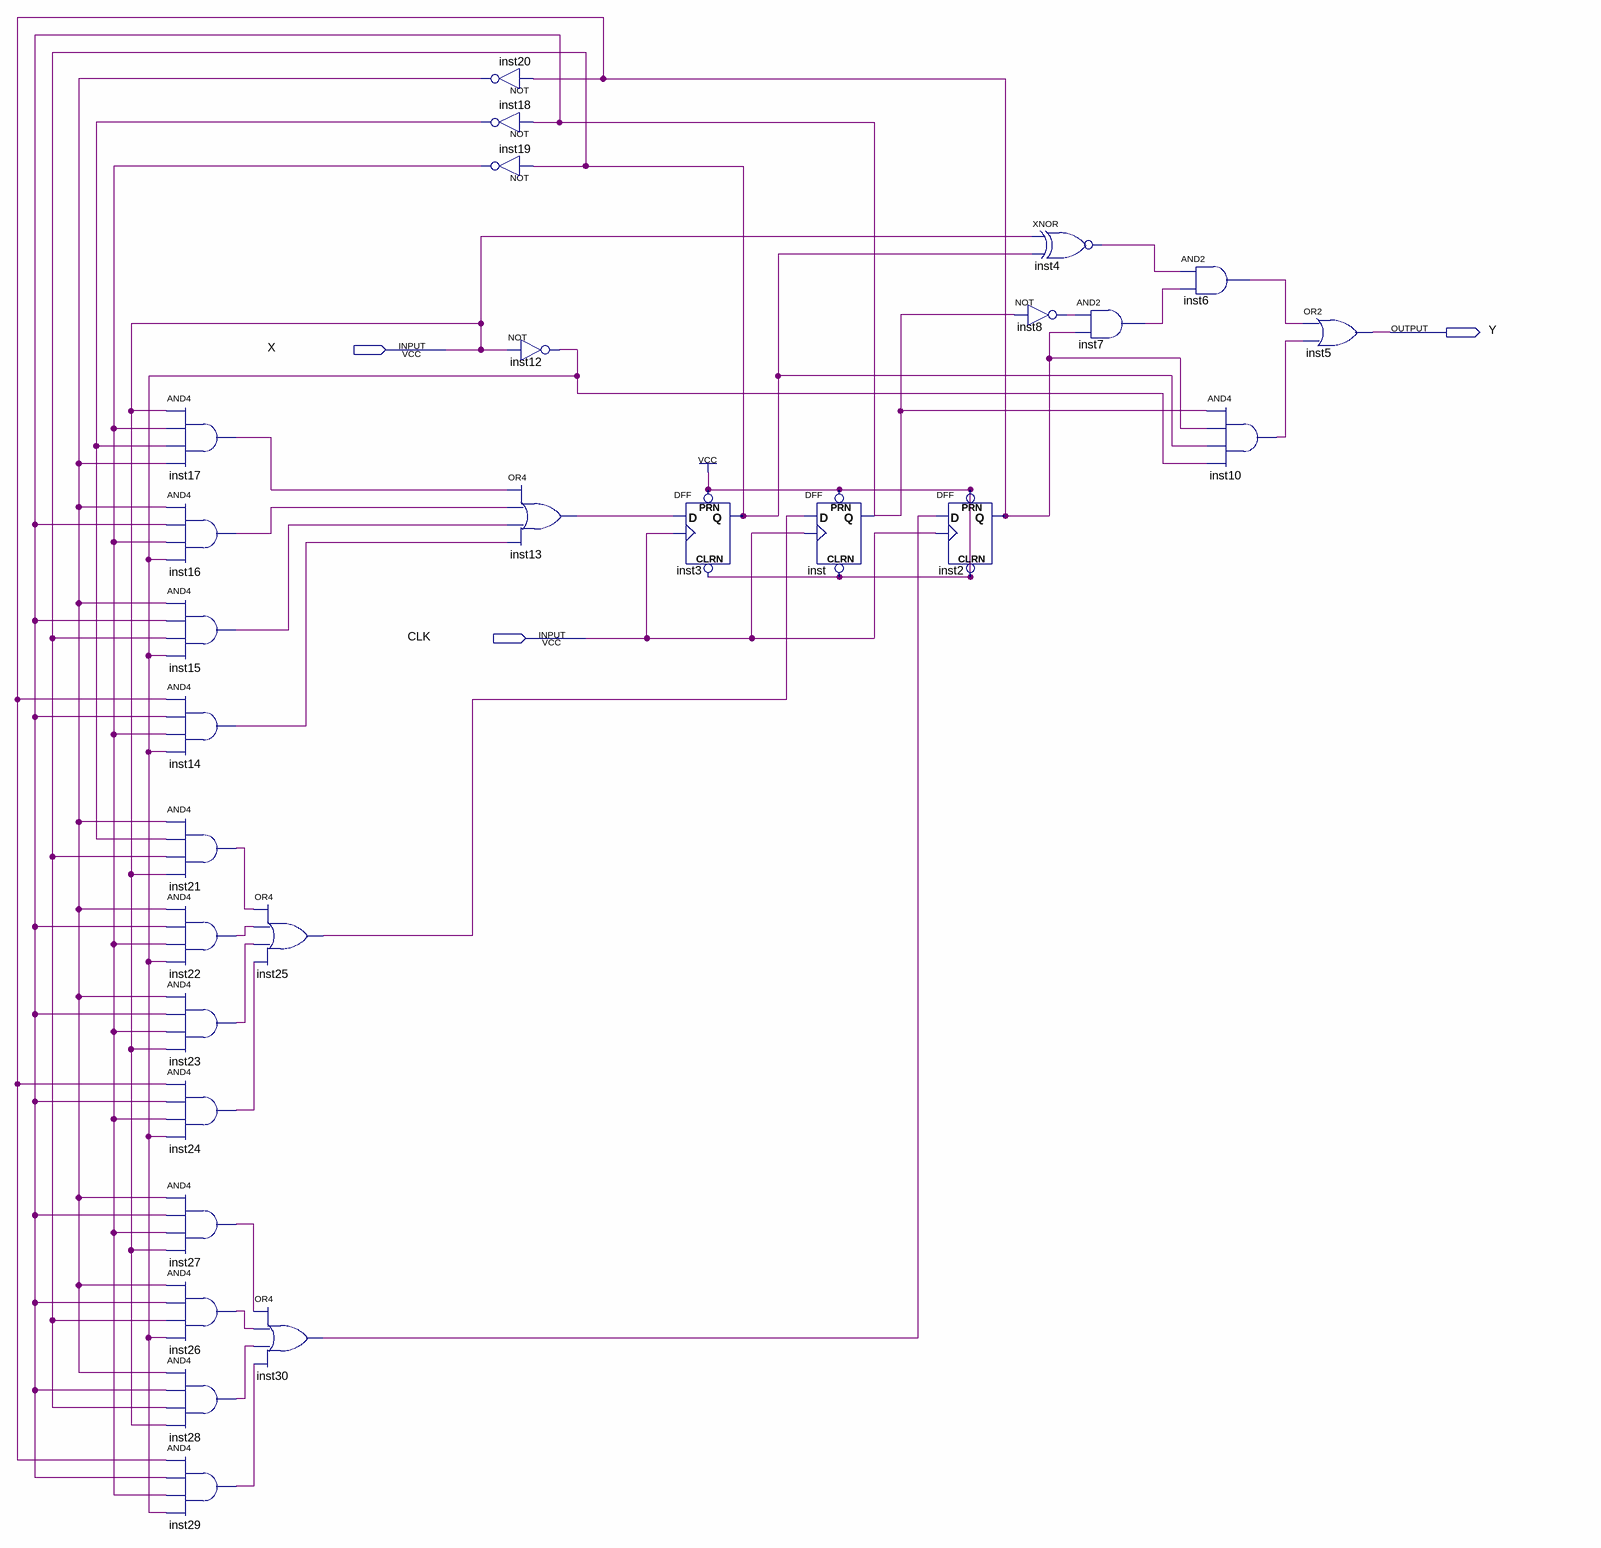
[diagram p0: schematic sheet]
// Quartus schematic SeqDet3in5.bdf as structural Verilog: 28 symbols, 3 pins
module SeqDet3in5 (
  input  X,
  input  CLK,
  output Y
);

  wire inst2_q, inst3_q, inst4_out, inst6_out, inst7_out, inst8_out, inst10_out, inst12_out, inst13_out,
       inst14_out, inst15_out, inst16_out, inst17_out, inst18_out, inst19_out, inst20_out, inst21_out,
       inst22_out, inst23_out, inst24_out, inst25_out, inst26_out, inst27_out, inst28_out, inst29_out,
       inst30_out, inst_q;

  and inst17 (inst17_out, X, inst19_out, inst18_out, inst20_out);
  and inst16 (inst16_out, inst20_out, inst_q, inst19_out, inst12_out);
  and inst15 (inst15_out, inst20_out, inst_q, inst3_q, inst12_out);
  and inst14 (inst14_out, inst2_q, inst_q, inst19_out, inst12_out);
  and inst21 (inst21_out, inst20_out, inst18_out, inst3_q, X);
  and inst22 (inst22_out, inst20_out, inst_q, inst19_out, inst12_out);
  and inst23 (inst23_out, inst20_out, inst_q, inst19_out, X);
  and inst24 (inst24_out, inst2_q, inst_q, inst19_out, inst12_out);
  and inst27 (inst27_out, inst20_out, inst_q, inst19_out, X);
  and inst26 (inst26_out, inst20_out, inst_q, inst3_q, inst12_out);
  and inst28 (inst28_out, inst20_out, inst_q, inst3_q, X);
  and inst29 (inst29_out, inst2_q, inst_q, inst19_out, inst12_out);
  or inst25 (inst25_out, inst21_out, inst22_out, inst23_out, inst24_out);
  or inst30 (inst30_out, inst27_out, inst26_out, inst28_out, inst29_out);
  not inst20 (inst20_out, inst2_q);
  not inst18 (inst18_out, inst_q);
  not inst19 (inst19_out, inst3_q);
  not inst12 (inst12_out, X);
  or inst13 (inst13_out, inst17_out, inst16_out, inst15_out, inst14_out);
  DFF inst3 (.CLRN(1'b1), .CLK(CLK), .D(inst13_out), .PRN(1'b1), .Q(inst3_q));
  DFF inst (.CLRN(1'b1), .CLK(CLK), .D(inst25_out), .PRN(1'b1), .Q(inst_q));
  DFF inst2 (.CLRN(1'b1), .CLK(CLK), .D(inst30_out), .PRN(1'b1), .Q(inst2_q));
  xnor inst4 (inst4_out, X, inst3_q);
  not inst8 (inst8_out, inst_q);
  and inst7 (inst7_out, inst8_out, inst2_q);
  and inst6 (inst6_out, inst4_out, inst7_out);
  and inst10 (inst10_out, inst_q, inst2_q, inst3_q, inst12_out);
  or inst5 (Y, inst6_out, inst10_out);
endmodule
